# Altium project HIGH_LEVEL_ELECTRONICS_PROJECT.PrjPcb
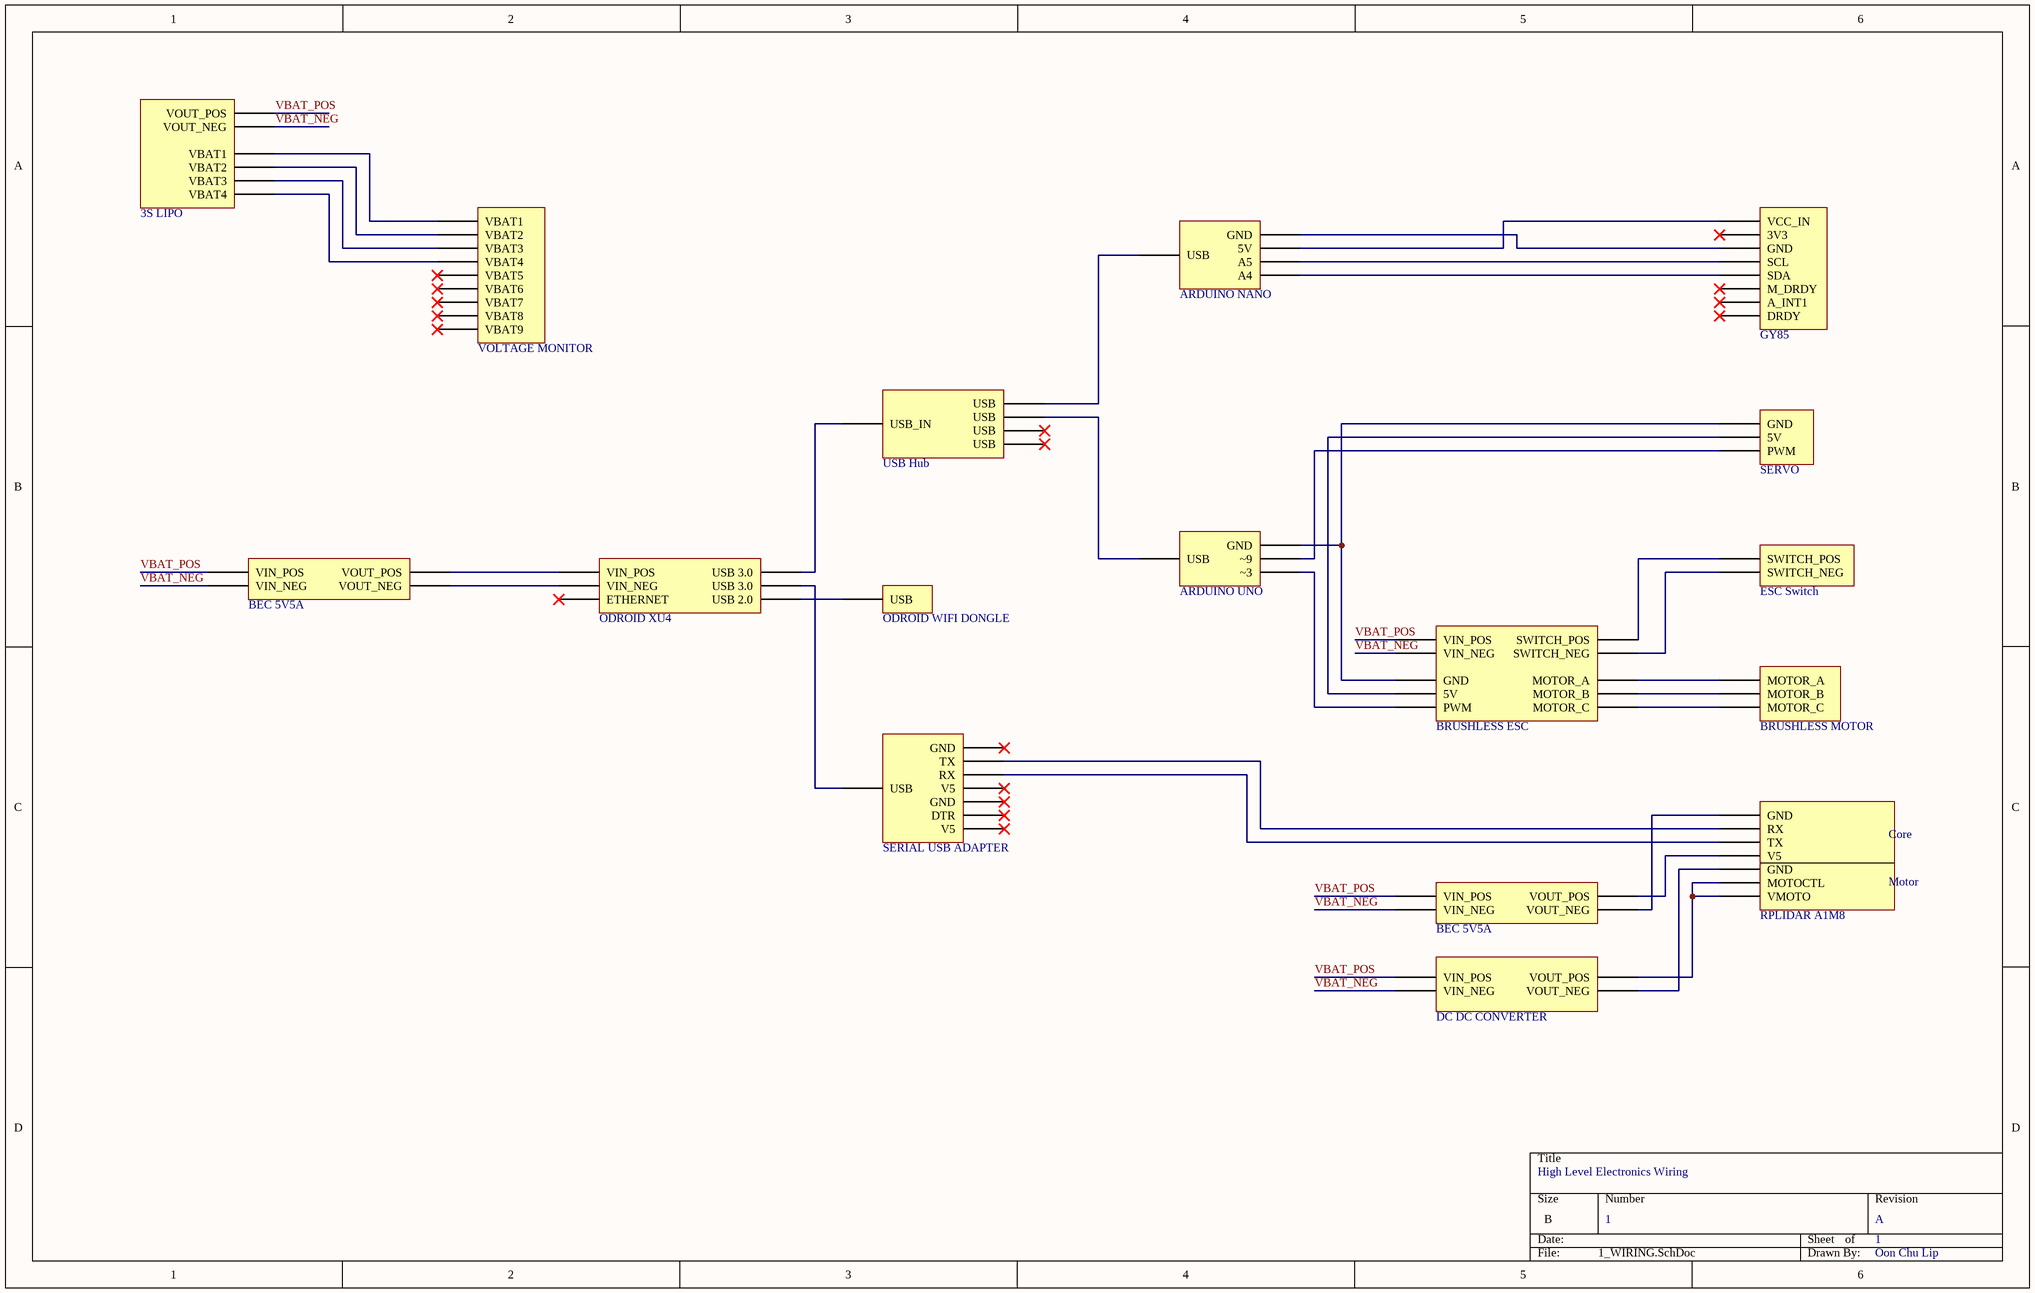
[diagram p0: 1_WIRING.SchDoc]
1 sheet, 17 parts. Net scope: global (net labels, ports and power ports of the same name join across sheets).

## Sheet 1_WIRING.SchDoc: High Level Electronics Wiring
size B; DrawnBy: Oon Chu Lip; DocumentNumber: 1; Revision: A; SheetNumber: 1; SheetTotal: 1

### Parts
*  ESC Switch
H1  VOLTAGE MONITOR
H2  GY85
H3  ARDUINO NANO
H4  USB Hub
H5  SERVO
H6  ARDUINO UNO
H7  BEC 5V5A
H8  ODROID XU4
H9  ODROID WIFI DONGLE
H10  BRUSHLESS ESC
H11  SERIAL USB ADAPTER
H12  RPLIDAR A1M8
H13  BEC 5V5A
H14  DC DC CONVERTER
M1  BRUSHLESS MOTOR
PS1  3S LIPO

### Nets
VBAT_NEG: H7.2(VIN_NEG) H10.2(VIN_NEG) H13.2(VIN_NEG) H14.2(VIN_NEG) PS1.2(VOUT_NEG)
VBAT_POS: H7.1(VIN_POS) H10.1(VIN_POS) H13.1(VIN_POS) H14.1(VIN_POS) PS1.1(VOUT_POS)
Net*_1: *.1(SWITCH_POS) H10.9(SWITCH_POS)
Net*_2: *.2(SWITCH_NEG) H10.10(SWITCH_NEG)
NetH1_1: H1.1(VBAT1) PS1.3(VBAT1)
NetH1_2: H1.2(VBAT2) PS1.4(VBAT2)
NetH1_3: H1.3(VBAT3) PS1.5(VBAT3)
NetH1_4: H1.4(VBAT4) PS1.6(VBAT4)
NetH2_1: H2.1(VCC_IN) H3.3(5V)
NetH2_3: H2.3(GND) H3.2(GND)
NetH2_4: H2.4(SCL) H3.4(A5)
NetH2_5: H2.5(SDA) H3.5(A4)
NetH3_1: H3.1(USB) H4.2(USB)
NetH4_1: H4.1(USB_IN) H8.3(USB_3.0)
NetH4_3: H4.3(USB) H6.1(USB)
NetH5_1: H5.1(GND) H6.2(GND) H10.3(GND)
NetH5_2: H5.2(5V) H10.4(5V)
NetH5_3: H5.3(PWM) H6.3(~9)
NetH6_4: H6.4(~3) H10.5(PWM)
NetH7_3: H7.3(VOUT_POS) H8.1(VIN_POS)
NetH7_4: H7.4(VOUT_NEG) H8.2(VIN_NEG)
NetH8_4: H8.4(USB_3.0) H11.8(USB)
NetH8_5: H8.5(USB_2.0) H9.1(USB)
NetH10_6: H10.6(MOTOR_A) M1.1(MOTOR_A)
NetH10_7: H10.7(MOTOR_B) M1.2(MOTOR_B)
NetH10_8: H10.8(MOTOR_C) M1.3(MOTOR_C)
NetH11_2: H11.2(TX) H12.6(RX)
NetH11_3: H11.3(RX) H12.5(TX)
NetH12_1: H12.1(VMOTO) H12.2(MOTOCTL) H14.3(VOUT_POS)
NetH12_3: H12.3(GND) H14.4(VOUT_NEG)
NetH12_4: H12.4(V5) H13.3(VOUT_POS)
NetH12_7: H12.7(GND) H13.4(VOUT_NEG)

Not connected (* = marked no-connect by the designer): H1 5(VBAT5)* 6(VBAT6)* 7(VBAT7)* 8(VBAT8)* 9(VBAT9)*; H2 2(3V3)* 6(M_DRDY)* 7(A_INT1)* 8(DRDY)*; H4 4(USB)* 5(USB)*; H8 6(ETHERNET)*; H11 1(GND)* 4(V5)* 5(GND)* 6(DTR)* 7(V5)*

### Notes on the sheet
- (in symbol Lidar) Core; Motor

### Library data of the parts
H2 = IMU
H7 H13 = BEC
H8 = Computer
H9 = Wifi Dongle
H10 = ESC
H12 = Lidar
PS1 = Battery